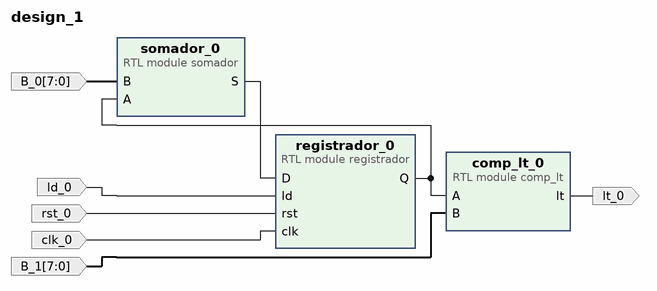
[diagram p0: block diagram of the top level]
# Vivado block design design_1, xc7z010clg400-1, Vivado 2017.4
create_bd_design design_1

create_bd_port -dir O lt_0
create_bd_port -dir I -from 7 -to 0 B_0
create_bd_port -dir I ld_0
create_bd_port -dir I -type rst rst_0
create_bd_port -dir I -type clk clk_0
create_bd_port -dir I -from 7 -to 0 B_1

create_bd_cell -type module -reference somador somador_0
create_bd_cell -type module -reference comp_lt comp_lt_0
create_bd_cell -type module -reference registrador registrador_0

# ---- connections ----

connect_bd_net [get_bd_pins registrador_0/Q] [get_bd_pins comp_lt_0/A] [get_bd_pins somador_0/A]
connect_bd_net [get_bd_pins comp_lt_0/lt] [get_bd_ports lt_0]
connect_bd_net -net B_0_1 [get_bd_ports B_0] [get_bd_pins somador_0/B]
connect_bd_net [get_bd_pins somador_0/S] [get_bd_pins registrador_0/D]
connect_bd_net -net ld_0_1 [get_bd_ports ld_0] [get_bd_pins registrador_0/ld]
connect_bd_net -net rst_0_1 [get_bd_ports rst_0] [get_bd_pins registrador_0/rst]
connect_bd_net -net clk_0_1 [get_bd_ports clk_0] [get_bd_pins registrador_0/clk]
connect_bd_net -net B_1_1 [get_bd_ports B_1] [get_bd_pins comp_lt_0/B]

validate_bd_design
save_bd_design
